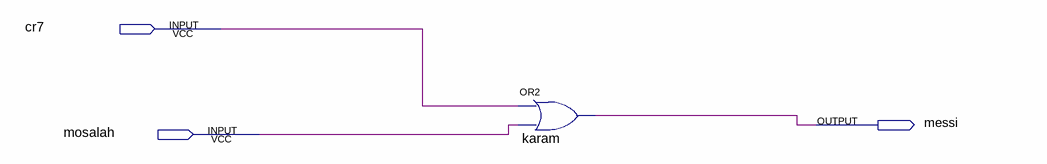
[diagram p0: schematic sheet]
// Quartus schematic 2_1_mux.bdf as structural Verilog: 1 symbols, 3 pins
module \2_1_mux  (
  input  cr7,
  input  mosalah,
  output messi
);

  or karam (messi, cr7, mosalah);
endmodule
